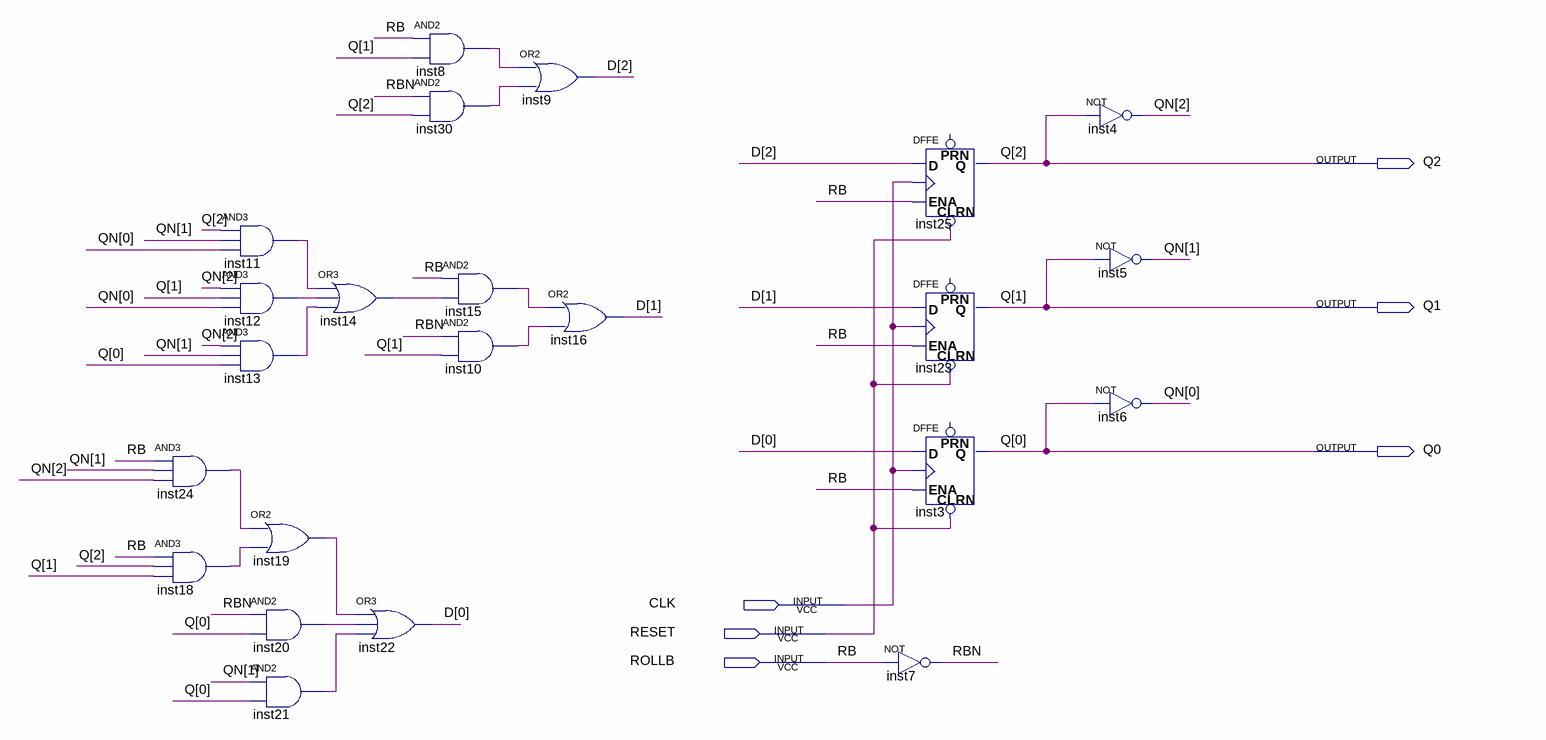
[diagram p0: schematic sheet]
// Quartus schematic DieCounter.bdf as structural Verilog: 23 symbols, 6 pins
module DieCounter (
  input  CLK,
  input  RESET,
  input  ROLLB,
  output Q2,
  output Q1,
  output Q0
);

  wire inst8_out, inst10_out, inst11_out, inst12_out, inst13_out, inst14_out, inst15_out, inst18_out,
       inst19_out, inst20_out, inst21_out, inst24_out, inst30_out, RBN;
  wire [2:0] D, QN;

  and inst24 (inst24_out, ROLLB, QN[1], QN[2]);
  and inst18 (inst18_out, ROLLB, Q2, Q1);
  and inst11 (inst11_out, Q2, QN[1], QN[0]);
  and inst12 (inst12_out, QN[2], Q1, QN[0]);
  and inst13 (inst13_out, QN[2], QN[1], Q0);
  or inst19 (inst19_out, inst24_out, inst18_out);
  and inst20 (inst20_out, RBN, Q0);
  and inst21 (inst21_out, QN[1], Q0);
  or inst14 (inst14_out, inst11_out, inst12_out, inst13_out);
  and inst8 (inst8_out, ROLLB, Q1);
  and inst30 (inst30_out, RBN, Q2);
  or inst22 (D[0], inst19_out, inst20_out, inst21_out);
  and inst15 (inst15_out, ROLLB, inst14_out);
  and inst10 (inst10_out, RBN, Q1);
  or inst9 (D[2], inst8_out, inst30_out);
  or inst16 (D[1], inst15_out, inst10_out);
  DFFE inst25 (.CLRN(RESET), .D(D[2]), .CLK(CLK), .ENA(ROLLB), .Q(Q2));  // open: PRN
  DFFE inst23 (.CLRN(RESET), .D(D[1]), .CLK(CLK), .ENA(ROLLB), .Q(Q1));  // open: PRN
  DFFE inst3 (.CLRN(RESET), .D(D[0]), .CLK(CLK), .ENA(ROLLB), .Q(Q0));  // open: PRN
  not inst7 (RBN, ROLLB);
  not inst4 (QN[2], Q2);
  not inst5 (QN[1], Q1);
  not inst6 (QN[0], Q0);

  // Other names for the same wires on the sheet: RB = ROLLB
endmodule
